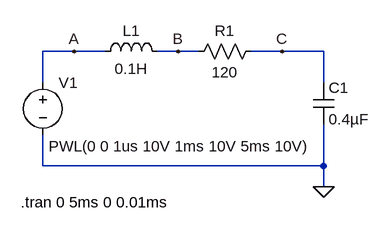
[diagram p0: schematic E2-RLC-tran.asc]
E2-RLC-tran.asc, the LTspice schematic file:
Version 4
SHEET 1 880 680
WIRE 16 80 -32 80
WIRE 64 80 16 80
WIRE 176 80 144 80
WIRE 208 80 176 80
WIRE 336 80 288 80
WIRE 400 80 336 80
WIRE -32 128 -32 80
WIRE 400 128 400 80
WIRE -32 256 -32 208
WIRE 400 256 400 192
WIRE 400 256 -32 256
WIRE 400 288 400 256
FLAG 400 288 0
FLAG 16 80 A
FLAG 176 80 B
FLAG 336 80 C
SYMBOL voltage -32 112 R0
WINDOW 3 9 114 Left 2
WINDOW 123 0 0 Left 0
WINDOW 39 0 0 Left 0
SYMATTR InstName V1
SYMATTR Value PWL(0 0 1us 10V 1ms 10V 5ms 10V)
SYMBOL ind 48 96 R270
WINDOW 0 32 56 VTop 2
WINDOW 3 5 56 VBottom 2
SYMATTR InstName L1
SYMATTR Value 0.1H
SYMBOL res 304 64 R90
WINDOW 0 0 56 VBottom 2
WINDOW 3 32 56 VTop 2
SYMATTR InstName R1
SYMATTR Value 120
SYMBOL cap 384 128 R0
SYMATTR InstName C1
SYMATTR Value 0.4µF
TEXT -66 312 Left 2 !.tran 0 5ms 0 0.01ms

The netlist it stands for:
* E2-RLC-tran.asc
V1 A 0 PWL(0 0 1us 10V 1ms 10V 5ms 10V)
L1 A B 0.1H
R1 C B 120
C1 C 0 0.4µF
.tran 0 5ms 0 0.01ms
.backanno
.end